# EAGLE schematic bamboo-monitor (EAGLE 7.4.0)
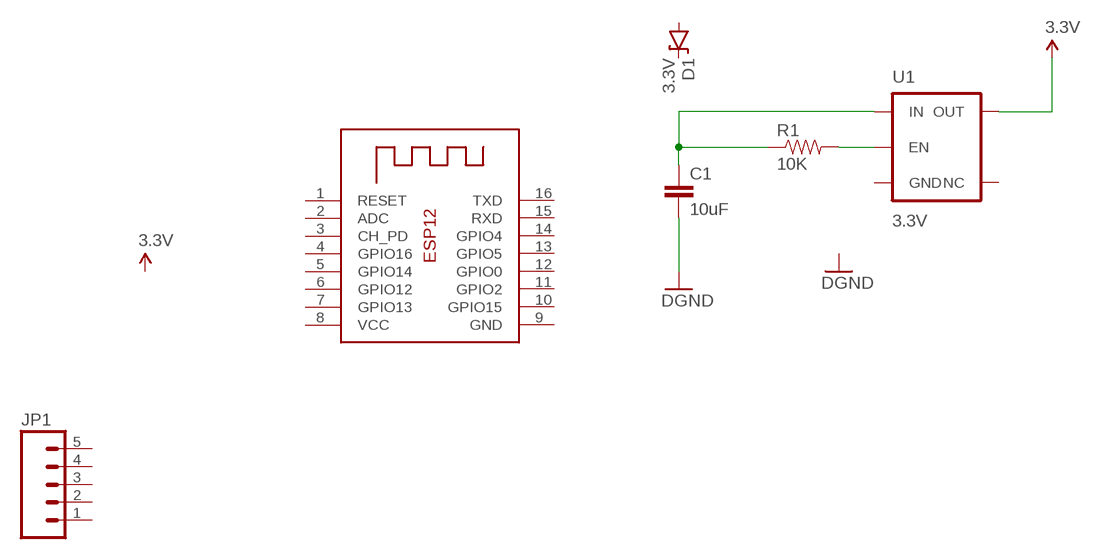
[diagram p0: schematic, sheet 1]

## Parts
C1  10uF  10UF-6.3V-20%(0603)  [0603-CAP]
D1  3.3V  DIODE-ZENER3.3V  [SOD-323]
JP1  M05PTH  [1X05]
R1  10K  10KOHM-1/10W-1%(0603)0603  [0603-RES]
U1  3.3V  V_REG_AP2112K-3.3V  [SOT23-5]
X1  ESP-12  [ESP-12]

## Nets
3.3V: U1.5(OUT)
GND: C1.2 ; supply symbol labelled DGND
N$1: C1.1 R1.1 U1.1(IN)
N$3: R1.2 U1.3(EN)
Unconnected: D1.A D1.C JP1.1 JP1.2 JP1.3 JP1.4 JP1.5 U1.2(GND) U1.4(NC) X1.1(RESET) X1.2(ADC) X1.3(CH_PD) X1.4(GPIO16) X1.5(GPIO14) X1.6(GPIO12) X1.7(GPIO13) X1.10(GPIO15) X1.11(GPIO2) X1.12(GPIO0) X1.13(GPIO5) X1.14(GPIO4) X1.15(RXD) X1.16(TXD)

## Power pins joined to a net without a drawn wire
GND: X1.9(GND)
VCC: X1.8(VCC)

## Library data of the parts
C1 = SparkFun-Capacitors:10UF-6.3V-20%(0603): CAP-11015; PROD_ID: CAP-11015
D1 = SparkFun-DiscreteSemi:DIODE-ZENER: Zener Diode Production Part - 8199 3.4V Zener Voltage; PROD_ID: DIO-11284
JP1 = SparkFun-Connectors:M05: Header 5 Standard 5-pin 0.1" header. Use with straight break away headers (SKU : PRT-00116), right angle break away headers (PRT-00553), swiss pins (PRT-00743), machine pins (PRT-00117), and female headers (PRT-00115). Molex polarized connector foot print use with SKU : PRT-08230 with associated crimp pins and housings.
R1 = SparkFun-Resistors:10KOHM-1/10W-1%(0603): RES-00824; PROD_ID: RES-00824
U1 = SparkFun-PowerIC:V_REG_AP2112: AP2112 - 600mA CMOS LDO Regulator w/ Enable The AP2112 is CMOS process low dropout linear regulator with enable function, the regulator delivers a guaranteed 600mA (min.) continuous load current. Features Output Voltage Accuracy: ±1.5% Output Current: 600mA (Min.) Foldback Short Current Protection: 50mA Enable Function to Turn ON/OFF VOUT Low Dropout Voltage (3.3V): 250mV (Typ.) @IOUT=600mA Excellent Load Regulation: 0.2%/A (Typ.) Excellent Line Regulation: 0.02%/V (Typ.) Low Quiescent Current: 55μA (Typ.) Low Standby Current: 0.01μA (Typ.) Low Output Noise: 50μVRMS PSRR: 100Hz -65dB, 1kHz -65dB OTSD Protection Stable with 1.0μF Flexible Cap: Ceramic, Tantalum and Aluminum Electrolytic Operation Temperature Range: -40°C to 85°C ESD: MM 400V, HBM 4000V; PROD_ID: VREG-12457
X1 = adafruit:ESP-12